# Altium schematic sheet mcu.SchDoc
size A3
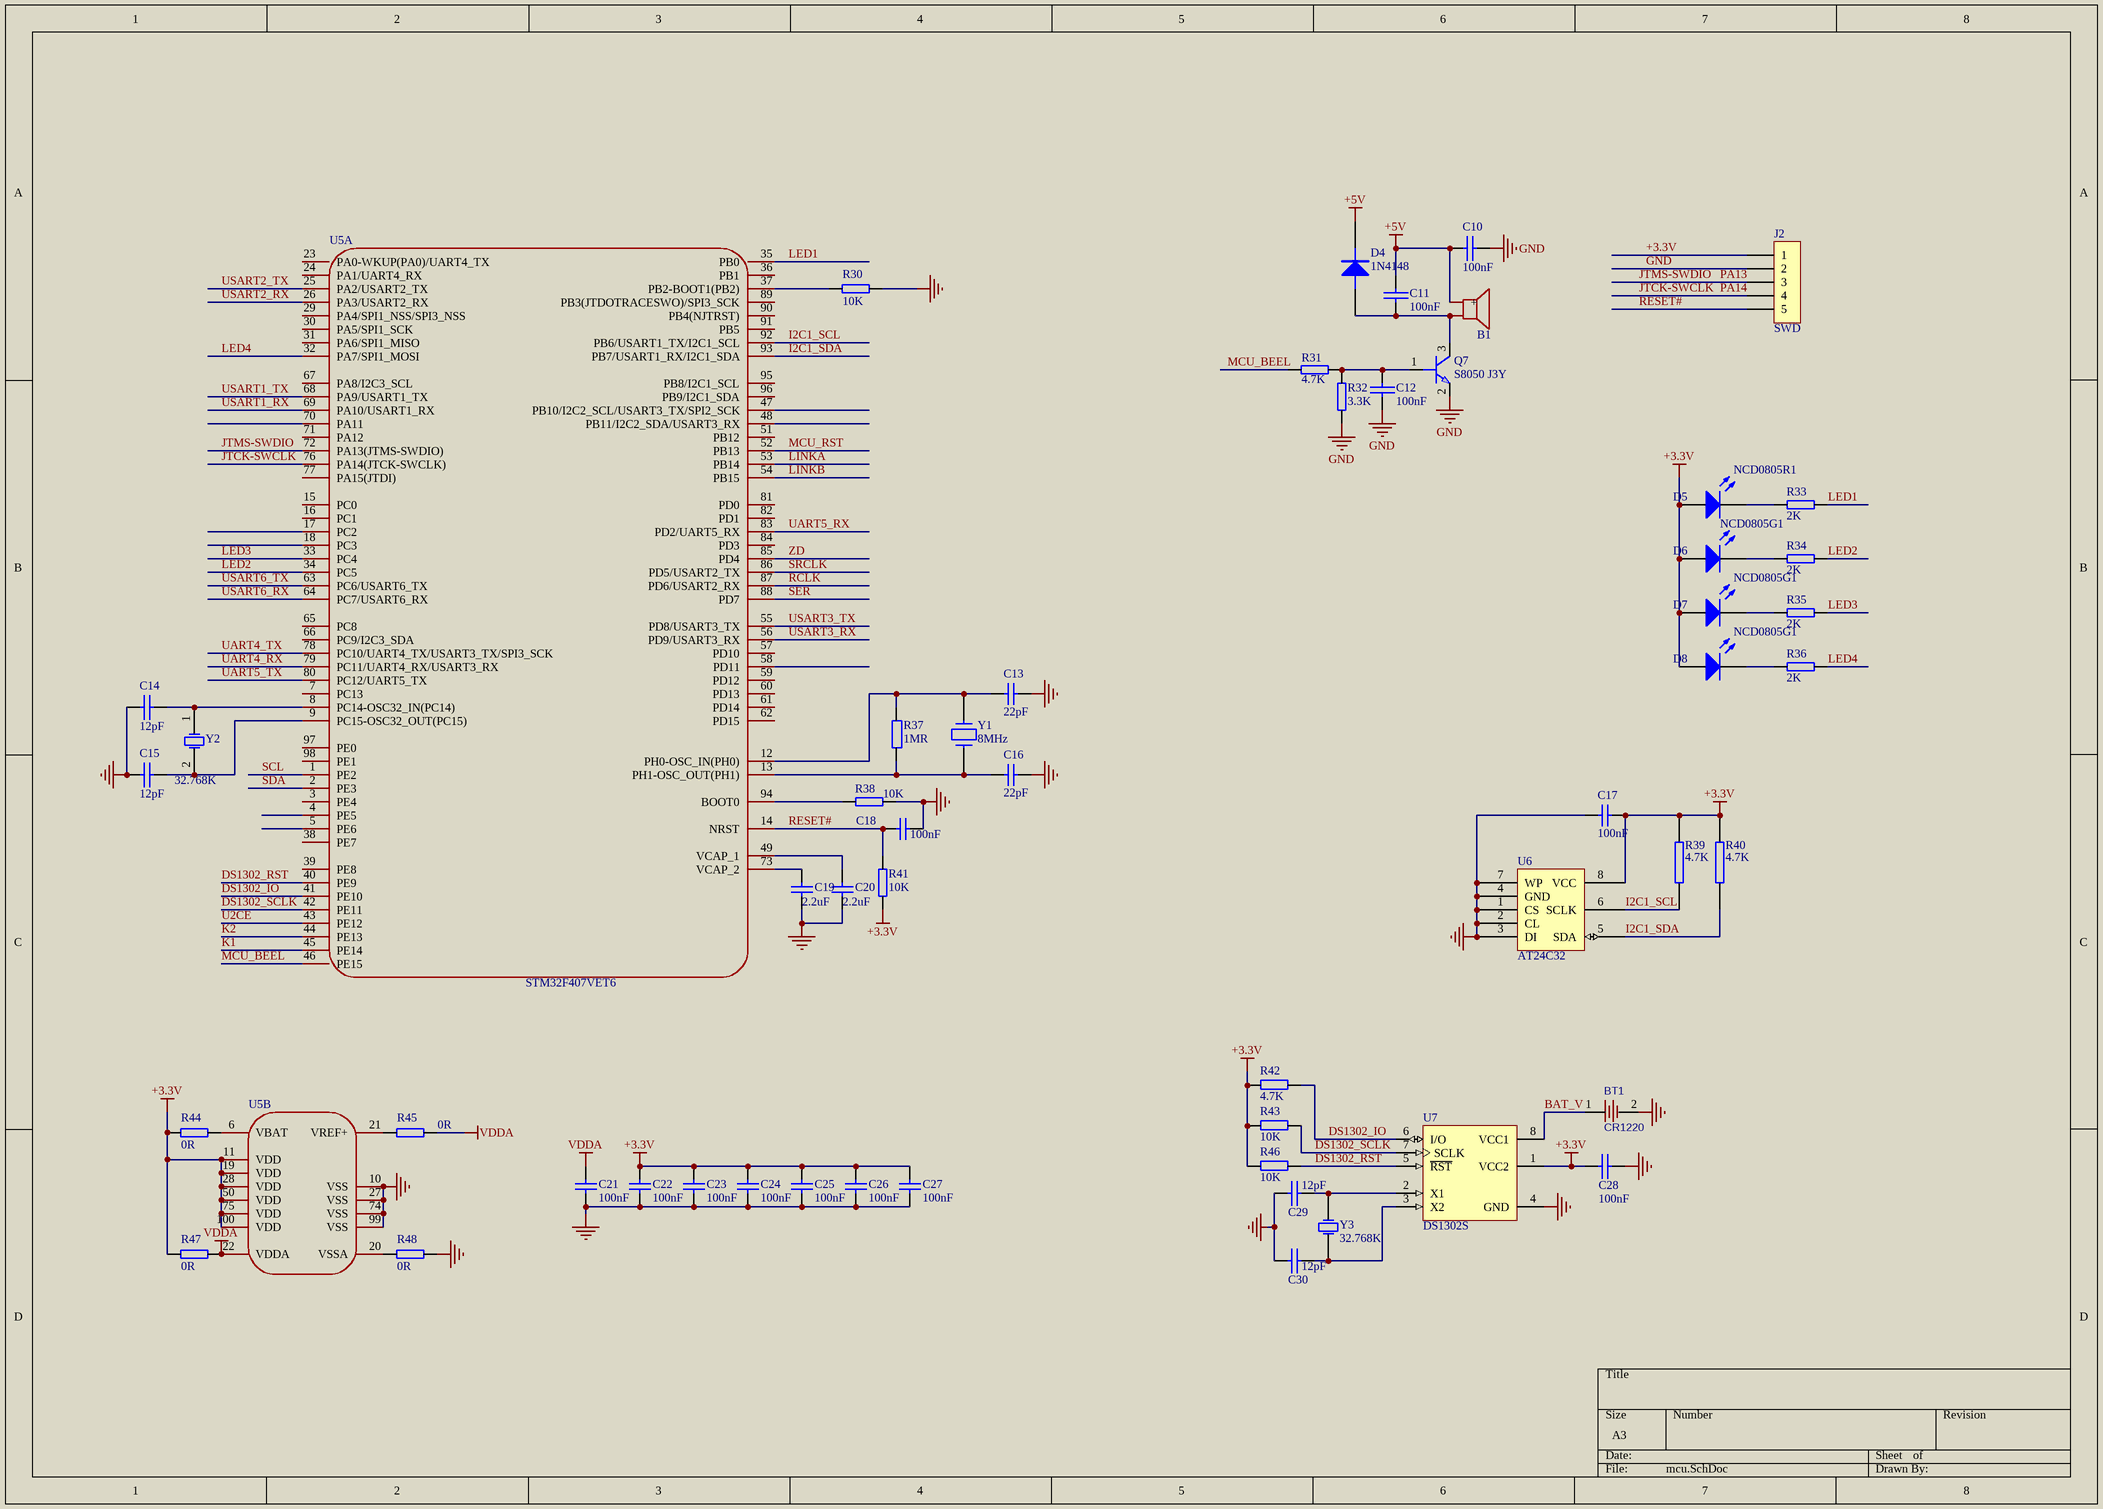
[diagram p0: mcu.SchDoc]

## Parts
B1  2.4kHz  [BUZ-TH_BD12.0-P7.60-D0.6-FD]  (value not drawn)
BT1  CR1220  [BAT-SMD_CR1220-2]
C10  100nF  [LC-0805_C]
C11  100nF  [LC-0805_C]
C12  100nF  [LC-0805_C]
C13  22pF  [LC-0805_C]
C14  12pF  [LC-0805_C]
C15  12pF  [LC-0805_C]
C16  22pF  [LC-0805_C]
C17  100nF  [LC-0805_C]
C18  100nF  [LC-0805_C]
C19  2.2uF  [LC-0805_C]
C20  2.2uF  [LC-0805_C]
C21  100nF  [LC-0805_C]
C22  100nF  [LC-0805_C]
C23  100nF  [LC-0805_C]
C24  100nF  [LC-0805_C]
C25  100nF  [LC-0805_C]
C26  100nF  [LC-0805_C]
C27  100nF  [LC-0805_C]
C28  100nF  [LC-0805_C]
C29  12pF  [LC-0805_C]
C30  12pF  [LC-0805_C]
D4  1N4148  [LC-SOD-123]
D5  NCD0805R1  [LC-0805_LED_S1]
D6  NCD0805G1  [LC-0805_LED_S1]
D7  NCD0805G1  [LC-0805_LED_S1]
D8  NCD0805G1  [LC-0805_LED_S1]
J2  SWD  [HDR1X5]
Q7  S8050 J3Y  [SOT-23]
R30  10K  [LC-0805_R]
R31  4.7K  [LC-0805_R]
R32  3.3K  [LC-0805_R]
R33  2K  [LC-0805_R]
R34  2K  [LC-0805_R]
R35  2K  [LC-0805_R]
R36  2K  [LC-0805_R]
R37  1MR  [LC-0805_R]
R38  10K  [LC-0805_R]
R39  4.7K  [LC-0805_R]
R40  4.7K  [LC-0805_R]
R41  10K  [LC-0805_R]
R42  4.7K  [LC-0805_R]
R43  10K  [LC-0805_R]
R44  0R  [LC-0805_R]
R45  0R  [LC-0805_R]
R46  10K  [LC-0805_R]
R47  0R  [LC-0805_R]
R48  0R  [LC-0805_R]
U5  STM32F407VET6  [LC-LQFP-100_14x14x05P]  (parts A,B of 2)
U6  AT24C32  [LC-SOIC-8_150mil]
U7  DS1302S  [LC-SOIC-8_150mil]
Y1  8MHz  [XTALSO]
Y2  32.768K  [LC-SMD-3215_2P FC - 135]
Y3  32.768K  [LC-SMD-3215_2P FC - 135]

## Nets
+3.3V: C17.1 C22.2 C23.2 C24.2 C25.2 C26.2 C27.2 C28.1 D5.1(A) D6.1(A) D7.1(A) D8.1(A) J2.1 R39.2 R40.2 R41.1 R42.2 R43.2 R44.1 R46.2 R47.1 U5.11(VDD) U5.19(VDD) U5.28(VDD) U5.50(VDD) U5.75(VDD) U5.100(VDD) U6.8(VCC) U7.1(VCC2)  [also labelled VCC]
+5V: B1.1(+) C10.1 C11.1 D4.2(K)
GND: BT1.2 C10.2 C12.2 C13.1 C14.1 C15.1 C16.2 C17.2 C18.2 C19.1 C20.1 C21.1 C22.1 C23.1 C24.1 C25.1 C26.1 C27.1 C28.2 C29.1 C30.1 J2.2 Q7.2(E) R30.2 R32.1 R38.2 R48.2 U5.10(VSS) U5.27(VSS) U5.74(VSS) U5.99(VSS) U6.1(CS) U6.2(CL) U6.3(DI) U6.4(GND) U6.7(WP) U7.4(GND)
VDDA: C21.2 R45.2 R47.2 U5.22(VDDA)
BAT_V: BT1.1 U7.8(VCC1)
DS1302_IO: R42.1 U5.41(PE10) U7.6(I/O)
DS1302_RST: R46.1 U5.40(PE9) U7.5(~{RST})
DS1302_SCLK: R43.1 U5.42(PE11) U7.7(SCLK)
I2C1_SCL: R39.1 U5.92(PB6/USART1_TX/I2C1_SCL) U6.6(SCLK)
I2C1_SDA: R40.1 U5.93(PB7/USART1_RX/I2C1_SDA) U6.5(SDA)
JTCK-SWCLK: J2.4 U5.76(PA14(JTCK-SWCLK))  [also labelled PA14]
JTMS-SWDIO: J2.3 U5.72(PA13(JTMS-SWDIO))  [also labelled PA13]
K1: U5.45(PE14)
K2: U5.44(PE13)
LED1: R33.1 U5.35(PB0)
LED2: R34.1 U5.34(PC5)
LED3: R35.1 U5.33(PC4)
LED4: R36.1 U5.32(PA7/SPI1_MOSI)
LINKA: U5.53(PB14)
LINKB: U5.54(PB15)
MCU_BEEL: R31.1 U5.46(PE15)
MCU_RST: U5.52(PB13)
RCLK: U5.87(PD6/USART2_RX)
RESET#: C18.1 J2.5 R41.2 U5.14(NRST)
SCL: U5.1(PE2)
SDA: U5.2(PE3)
SER: U5.88(PD7)
SRCLK: U5.86(PD5/USART2_TX)
U2CE: U5.43(PE12)
UART4_RX: U5.79(PC11/UART4_RX/USART3_RX)
UART4_TX: U5.78(PC10/UART4_TX/USART3_TX/SPI3_SCK)
UART5_RX: U5.83(PD2/UART5_RX)
UART5_TX: U5.80(PC12/UART5_TX)
USART1_RX: U5.69(PA10/USART1_RX)
USART1_TX: U5.68(PA9/USART1_TX)
USART2_RX: U5.26(PA3/USART2_RX)
USART2_TX: U5.25(PA2/USART2_TX)
USART3_RX: U5.56(PD9/USART3_RX)
USART3_TX: U5.55(PD8/USART3_TX)
USART6_RX: U5.64(PC7/USART6_RX)
USART6_TX: U5.63(PC6/USART6_TX)
ZD: U5.85(PD4)
NetB1_2: B1.2 C11.2 D4.1(A) Q7.3(C)
NetC12_1: C12.1 Q7.1(B) R31.2 R32.2
NetC13_2: C13.2 R37.2 U5.12(PH0-OSC_IN(PH0)) Y1.1
NetC14_2: C14.2 U5.8(PC14-OSC32_IN(PC14)) Y2.1(OSC1)
NetC15_2: C15.2 U5.9(PC15-OSC32_OUT(PC15)) Y2.2(OSC2)
NetC16_1: C16.1 R37.1 U5.13(PH1-OSC_OUT(PH1)) Y1.2
NetC19_2: C19.2 U5.73(VCAP_2)
NetC20_2: C20.2 U5.49(VCAP_1)
NetC29_2: C29.2 U7.2(X1) Y3.2(OSC2)
NetC30_2: C30.2 U7.3(X2) Y3.1(OSC1)
NetD5_2: D5.2(K) R33.2
NetD6_2: D6.2(K) R34.2
NetD7_2: D7.2(K) R35.2
NetD8_2: D8.2(K) R36.2
NetR30_1: R30.1 U5.37(PB2-BOOT1(PB2))
NetR38_1: R38.1 U5.94(BOOT0)
NetR44_2: R44.2 U5.6(VBAT)
NetR45_1: R45.1 U5.21(VREF+)
NetR48_1: R48.1 U5.20(VSSA)

Not connected (* = marked no-connect by the designer): U5 3(PE4) 4(PE5) 5(PE6) 7(PC13) 15(PC0) 16(PC1) 17(PC2) 18(PC3) 23(PA0-WKUP(PA0)/UART4_TX) 24(PA1/UART4_RX) 29(PA4/SPI1_NSS/SPI3_NSS) 30(PA5/SPI1_SCK) 31(PA6/SPI1_MISO) 36(PB1) 38(PE7) 39(PE8) 47(PB10/I2C2_SCL/USART3_TX/SPI2_SCK) 48(PB11/I2C2_SDA/USART3_RX) 51(PB12) 57(PD10) 58(PD11) 59(PD12) 60(PD13) 61(PD14) 62(PD15) 65(PC8) 66(PC9/I2C3_SDA) 67(PA8/I2C3_SCL) 70(PA11) 71(PA12) 77(PA15(JTDI)) 81(PD0) 82(PD1) 84(PD3) 89(PB3(JTDOTRACESWO)/SPI3_SCK) 90(PB4(NJTRST)) 91(PB5) 95(PB8/I2C1_SCL) 96(PB9/I2C1_SDA) 97(PE0) 98(PE1); Y3 0(GND)

## Library data of the parts
B1 = TMB12A05_C96093: Manufacturer: 华能; Add into BOM: yes; Driver Circuitry: 有源(内含驱动线路); Voltage - Supply: 4V~8V; Sound Pressure Level(SPL): 85dB; Symbol: TMB12A05; Device: TMB12A05_C96093; LCSC Part Name: TMB12A05; Supplier Part: C96093; Manufacturer Part: TMB12A05; Supplier Footprint: 插件,D=12mm; JLCPCB Part Class: Extended Part; Datasheet: https://atta.szlcsc.com/upload/public/pdf/source/20241025/8A17FE04D767D19A35A06DEF9A82AB1E.pdf; Supplier: LCSC; Convert to PCB: yes; Technology: 电磁式; Voltage Rating: -; Value: 2.4kHz; Current Consumption: -; Diameter(φD): 12mm; Length: -; Width: -; Height: 9.8mm; Operating Temperature: -
BT1 = 1056TR: BOM_Manufacturer: Keystone; Contributor: LCSC; BOM_Supplier: LCSC; BOM_Supplier Part: C238068; BOM_Manufacturer Part: 1056TR; spicePre: B; spiceSymbolName: 1056TR
C10-C12 C17 C18 C21-C27 = CAP: Capacitor
  C17 C18 C21-C27: Published: 8-Jun-2000; Revision: July-2002: Re-released for DXP Platform.; Publisher: Altium Limited; Value: 100nF
C13 C16 C19 C20 = CAP: Capacitor; Value: 100nF; Published: 8-Jun-2000; Revision: July-2002: Re-released for DXP Platform.; Publisher: Altium Limited
C14 C15 C28-C30 = 普通电容: Capacitor
D4 = DIODE
D5-D8 = LED2: Typical RED, GREEN, YELLOW, AMBER GaAs LED; Published: 8-Jun-2000; LatestRevisionDate: 17-Jul-2002; LatestRevisionNote: Re-released for DXP Platform.; PackageVersion: Feb-2002; PackageReference: 3.2X1.6X1.1; Publisher: Altium Limited; PackageDescription: SM LED; 2 Flat Leads
J2 = CON5: Connector
Q7 = 2N5551: Text Field1: 20; Text Field2: 20
R30-R36 R38 R41 R44 R45 R47 R48 = RES22: 1K
R37 R42 R43 R46 = R
R39 R40 = RES2
U5 = STM32F407VET6: Manufacturer: ST(意法半导体); Add into BOM: yes; CPU Core: ARM-M4; CPU Maximum Speed: 168MHz; Program Storage Size: 512KB; Program Memory Type: FLASH; Number of I/O: 82; ADC (Bit): 12bit; Voltage - Supply: 1.8V~3.6V; Symbol: STM32F407VET6; Device: STM32F407VET6; LCSC Part Name: 带DSP和FPU的高性能基础系列ARM Cortex-M4 MCU，具有512 KB Flash、168 MHz CPU、ART加速器、以太网和FSMC; Supplier Part: C28730; Manufacturer Part: STM32F407VET6; Supplier Footprint: LQFP-100(14x14); JLCPCB Part Class: Extended Part; Datasheet: https://atta.szlcsc.com/upload/public/pdf/source/20140801/1457707197138.pdf; Supplier: LCSC; Convert to PCB: yes; DAC (Bit): 12bit; Applications: -
U6 = 24C64
U7 = DS1302S: Trickle Charge Timekeeping Chip; Published: 13-Oct-2000; LatestRevisionDate: 13-Apr-2006; LatestRevisionNote: IPC-7351 Footprint Added.; DatasheetVersion: 2-Jul-1999; PackageVersion: 1994; PackageReference: SOIC8WA; Publisher: Altium Limited; PackageDescription: 8-Pin Small Outline Package 1.27 mm Pitch; ComponentLink1Description: Manufacturer Link; ComponentLink1URL: http://www.maxim-ic.com/; ComponentLink2Description: Datasheet; ComponentLink2URL: http://pdfserv.maxim-ic.com/en/ds/DS1302.pdf; ComponentLink3Description: Discontinuation Notice; ComponentLink3URL: http://www.maxim-ic.com/qa/pdfs/non-obsolescence-letter.pdf
Y1 = CRYSTAL
Y2 Y3 = XTAL: Crystal Oscillator; Published: 8-Jun-2000; LatestRevisionDate: 17-Jul-2002; LatestRevisionNote: Re-released for DXP Platform.; PackageReference: R38; Publisher: Altium Limited; PackageDescription: Crystal, Thru-Hole; 2 Leads; Body 3.1 x 8.2 mm (Dia.xH)